# Altium schematic sheet 反馈控制分图.SchDoc
size A4
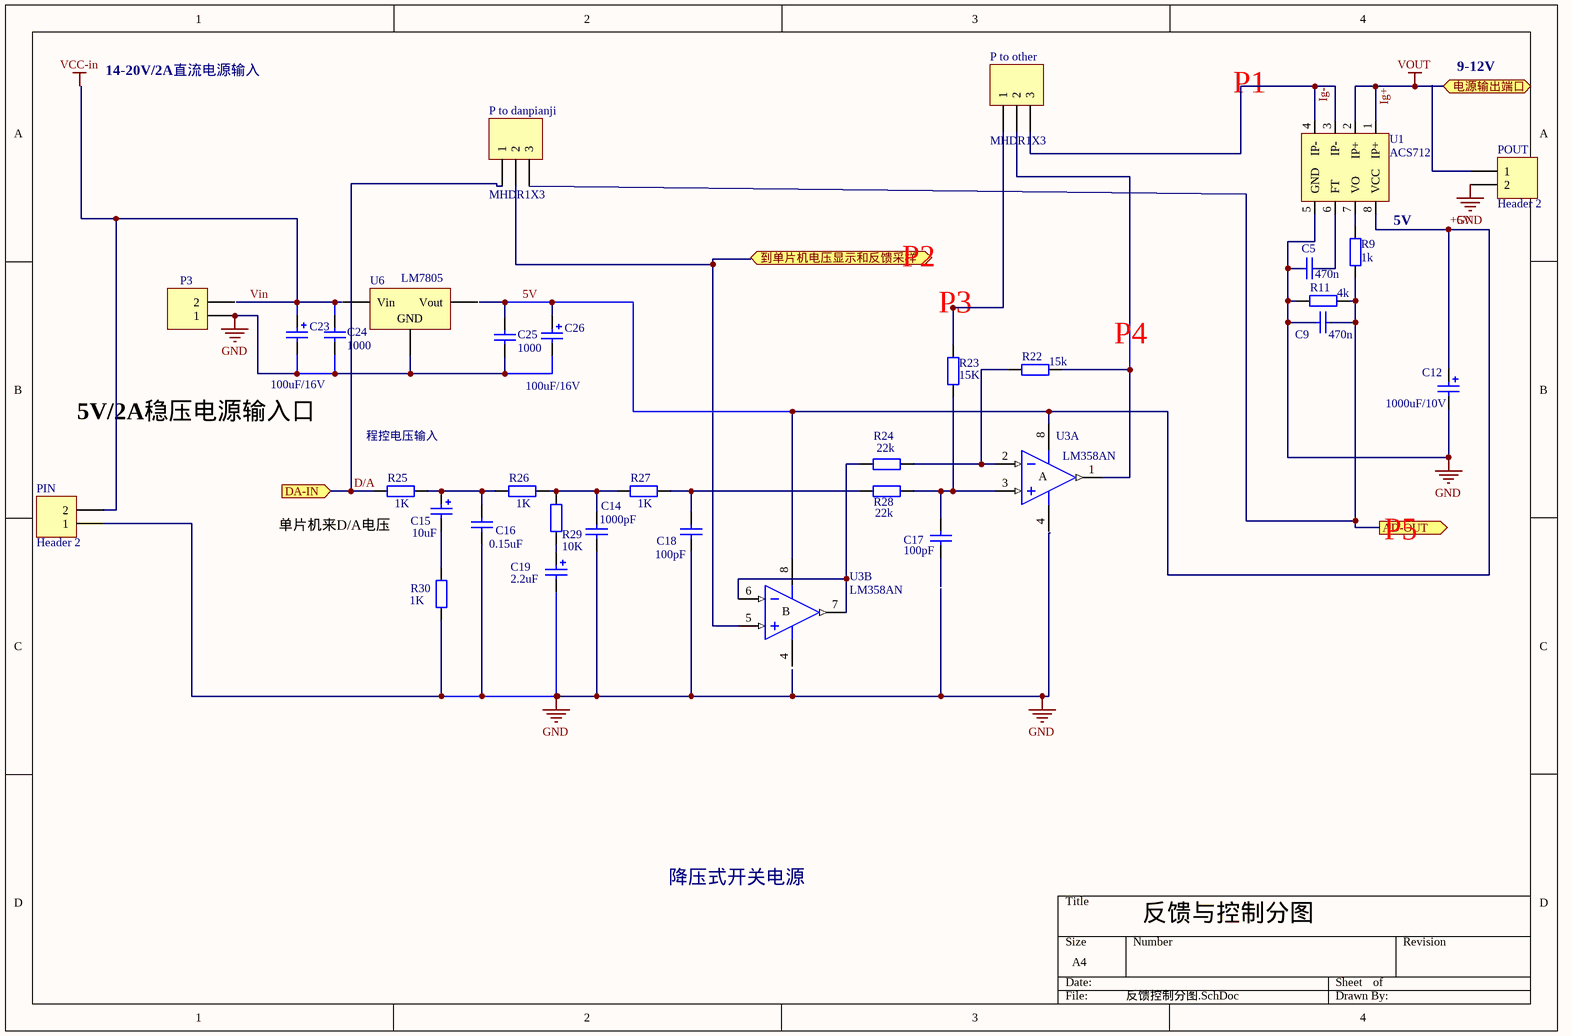
[diagram p0: 反馈控制分图.SchDoc]

## Parts
C5  value 470n  [瓷片电容]  (hidden comment: 275VAC)
C9  value 470n  [瓷片电容]  (hidden comment: 275VAC)
C12  value 1000uF/10V  [100电解电容]  (hidden comment: Cap Pol2)
C14  value 1000pF  [瓷片电容]  (hidden comment: Cap)
C15  value 10uF  [10uf]  (hidden comment: Cap Pol2)
C16  value 0.15uF  [瓷片电容]  (hidden comment: Cap)
C17  value 100pF  [瓷片电容]  (hidden comment: Cap Semi)
C18  value 100pF  [瓷片电容]  (hidden comment: Cap)
C19  value 2.2uF  [10uf]  (hidden comment: Cap Pol2)
C23  value 100uF/16V  [100电解电容]  (hidden comment: Cap Pol2)
C24  value 1000  [瓷片电容]  (hidden comment: Cap)
C25  value 1000  [瓷片电容]  (hidden comment: Cap)
C26  value 100uF/16V  [100电解电容]  (hidden comment: Cap Pol2)
P3  MHDR1X2  [MHDR1X2]  (value not drawn)
P_to_danpianji  MHDR1X3  [MHDR1X3]
P_to_other  MHDR1X3  [MHDR1X3]
PIN  Header 2  [HDR1X2]
POUT  Header 2  [HDR1X2]
R9  value 1k  [AXIAL-0.3]  (hidden comment: Res2)
R11  value 4k  [AXIAL-0.3]  (hidden comment: Res2)
R22  value 15k  [AXIAL-0.3]  (hidden comment: Res2)
R23  value 15K  [AXIAL-0.4]  (hidden comment: Res2)
R24  value 22k  [AXIAL-0.3]  (hidden comment: Res2)
R25  value 1K  [AXIAL-0.4]  (hidden comment: Res2)
R26  value 1K  [AXIAL-0.4]  (hidden comment: Res2)
R27  value 1K  [AXIAL-0.4]  (hidden comment: Res2)
R28  value 22k  [AXIAL-0.3]  (hidden comment: Res2)
R29  value 10K  [AXIAL-0.4]  (hidden comment: Res2)
R30  value 1K  [AXIAL-0.4]  (hidden comment: Res2)
U1  ACS712  [HDR2X4]
U3  LM358AN  [HDR2X4_CEN]  (parts A,B of 4)
U6  LM7805  [TO-220-AB]

## Ports
AD-OUT (out), DA-IN (in), 到单片机电压显示和反馈采样 (out), 电源输出端口

## Nets
GND: C5.1 C9.2 C12.2 C14.1 C18.1 C19.2 C23.2 C24.1 C25.1 C26.2 P3.1 POUT.2 R11.1 U1.5(GND) U6.2(GND)
Ig+: U1.1(IP+) U1.2(IP+) ; port 电源输出端口  [also labelled VOUT]
5V: C12.1 C25.2 C26.1 U1.8(VCC) U3.8(V+)
AD-OUT: C9.1 P_to_danpianji.3 R9.1 R11.2 ; port AD-OUT
D/A: P_to_danpianji.1 R25.1 ; port DA-IN
Ig-: P_to_other.3 U1.3(IP-) U1.4(IP-)
Vin: C23.1 C24.2 PIN.2
NetC5_2: C5.2 U1.6(FT)
NetC14_2: C14.2 R26.2 R27.1 R29.2
NetC15_1: C15.1 C16.2 R25.2 R26.1
NetC15_2: C15.2 R30.2
NetC16_1: C16.1 PIN.1 R30.1
NetC17_2: C17.2 R23.1 R28.2 U3.3(IN+)
NetC18_2: C18.2 R27.2 R28.1
NetC19_1: C19.1 R29.1
NetP_to_danpianji_2: P_to_danpianji.2 U3.5(IN+)
NetP_to_other_1: P_to_other.1 R23.2
NetP_to_other_2: P_to_other.2 R22.2 U3.1(OUT)
NetR9_2: R9.2 U1.7(VO)
NetR22_1: R22.1 R24.2 U3.2(IN-)
NetR24_1: R24.1 U3.6(IN-) U3.7(OUT)

Not connected (* = marked no-connect by the designer): C17 1; P3 2; POUT 1; U3 4(V-); U6 1(Vin) 3(Vout)

## Notes on the sheet
- 14-20V/2A直流电源输入
- P1
- 9-12V
- (near U1) 5V
- P2
- (near R23) P3
- P4
- 5V/2A稳压电源输入口
- 程控电压输入
- (near R25) 单片机来D/A电压
- P5
- 降压式开关电源
- 反馈与控制分图
- Labels drawn without touching a wire or pin: +5V, VCC-in
- (in symbol LM324AN, part A) A
- (in symbol LM324AN, part B) B

## Library data of the parts
C5 C9 = Cap: ECQ-U2A334ML; Published: 8-Jun-2000; LatestRevisionDate: 17-Jul-2002; LatestRevisionNote: Re-released for DXP Platform.; PackageReference: RAD-0.3; Publisher: Altium Limited
C12 C15 C19 C23 C26 = Cap Pol2: Polarized Capacitor (Axial); Published: 8-Jun-2000; LatestRevisionDate: 17-Jul-2002; LatestRevisionNote: Re-released for DXP Platform.; PackageReference: POLAR0.8; Publisher: Altium Limited
C14 C16 C18 C24 C25 = Cap: Capacitor; Published: 8-Jun-2000; LatestRevisionDate: 17-Jul-2002; LatestRevisionNote: Re-released for DXP Platform.; PackageReference: RAD-0.3; Publisher: Altium Limited
C17 = Cap Semi: Capacitor (Semiconductor SIM Model); Published: 8-Jun-2000; LatestRevisionDate: 17-Jul-2002; LatestRevisionNote: Re-released for DXP Platform.; PackageReference: C1206; Publisher: Altium Limited
P3 = MHDR1X2: Header, 2-Pin; LatestRevisionDate: 17-Jul-2002; LatestRevisionNote: Re-released for DXP Platform.; Publisher: Altium Limited
P_to_danpianji P_to_other = MHDR1X3: Header, 3-Pin; LatestRevisionDate: 17-Jul-2002; LatestRevisionNote: Re-released for DXP Platform.; Publisher: Altium Limited
PIN POUT = Header 2: Header, 2-Pin; LatestRevisionDate: 17-Jul-2002; LatestRevisionNote: Re-released for DXP Platform.; Publisher: Altium Limited
R9 R11 R22-R30 = Res2: Resistor; Published: 8-Jun-2000; LatestRevisionDate: 17-Jul-2002; LatestRevisionNote: Re-released for DXP Platform.; Publisher: Altium Limited
  R23: PackageReference: AXIAL-0.4; PackageDescription: Axial Device, Thru-Hole; 2 Leads; 0.4 in Pin Spacing
  R25-R27 R29 R30: PackageReference: AXIAL-0.4
U3 = LM324AN: Low-Power Quad Operational Amplifier; Published: 24-Aug-2001; LatestRevisionDate: 17-Jul-2002; LatestRevisionNote: Re-released for DXP Platform.; DatasheetDocument: Nov-1997; PackageDocument: Jan-1997; PackageReference: DIP14; Publisher: Altium Limited
U6 = Volt Reg: Voltage Regulator; Published: 24-Mar-1999; LatestRevisionDate: 17-Jul-2002; LatestRevisionNote: Re-released for DXP Platform.; PackageReference: D2PAK; Publisher: Altium Limited; Code_JEDEC: SMD-220